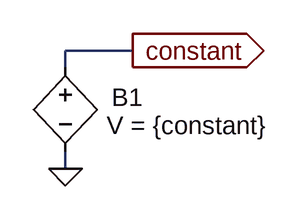
[diagram p0: schematic constant_module.asc]
constant_module.asc, the LTspice schematic file:
Version 4
SHEET 1 880 680
WIRE 240 160 176 160
WIRE 176 176 176 160
WIRE 176 272 176 256
FLAG 176 272 0
FLAG 240 160 constant
IOPIN 240 160 Out
SYMBOL bv 176 160 R0
WINDOW 0 44 44 Left 0
WINDOW 3 39 71 Left 0
SYMATTR InstName B1
SYMATTR Value V = {constant}

The netlist it stands for:
* constant_module.asc
B1 constant 0 V = {constant}
.backanno
.end